# Altium project TG21_Slave_Device_Amply_V1.2.PrjPcb
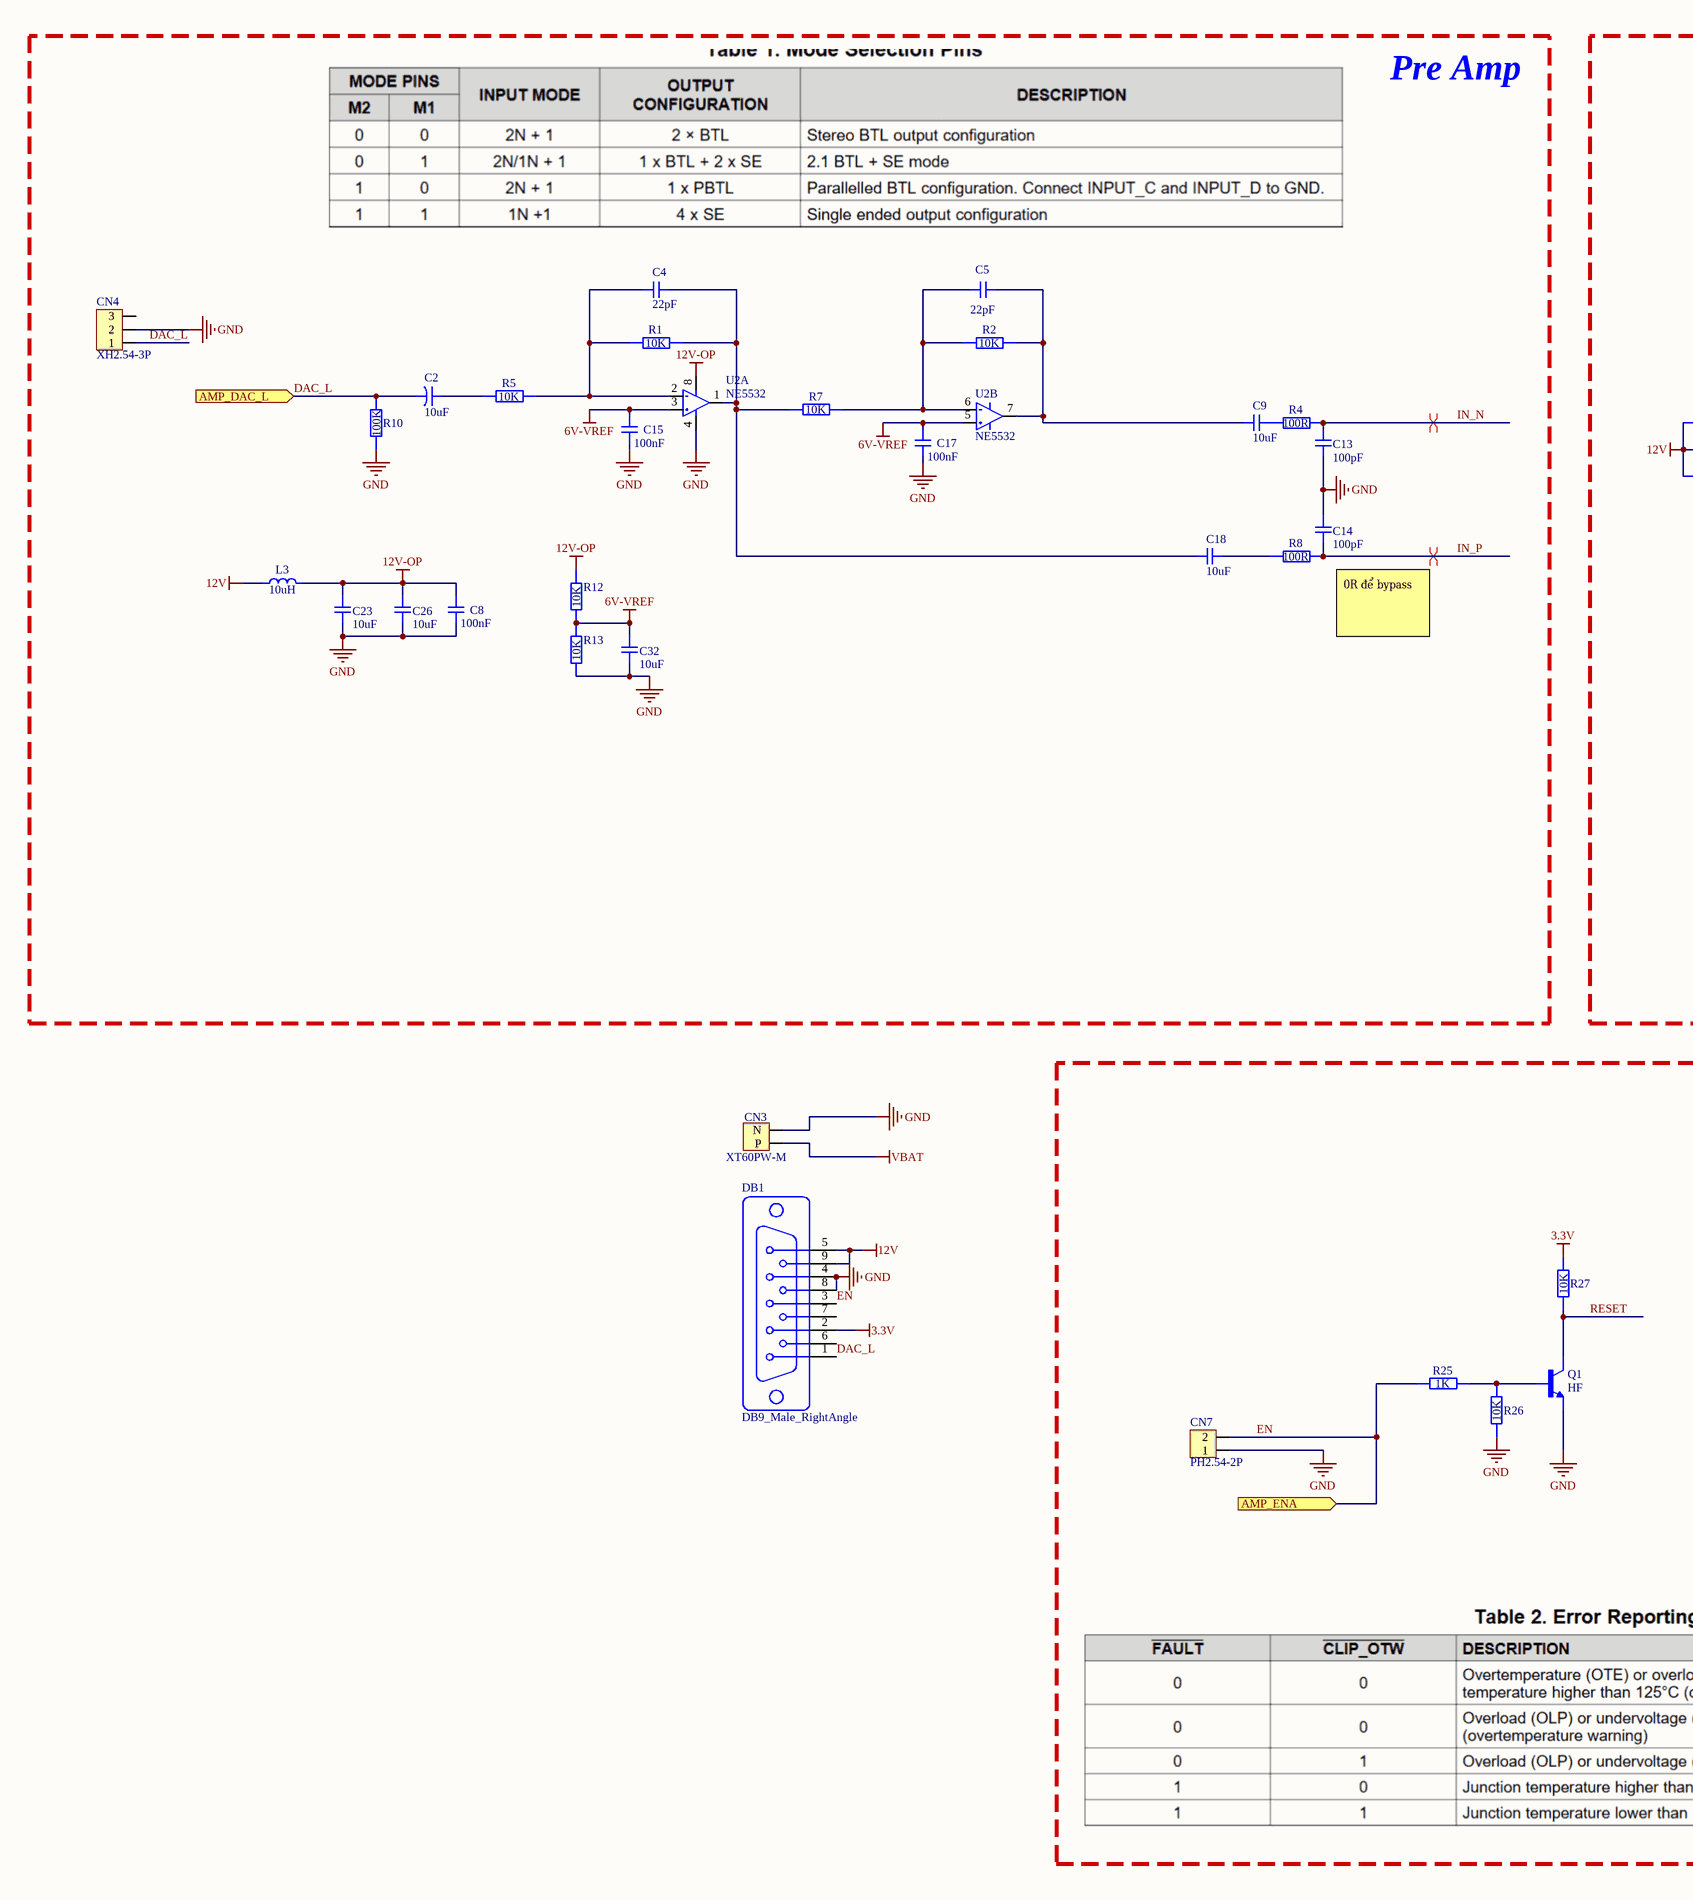
[diagram p0: TG21_Slave_Device_Amply.SchDoc, left]
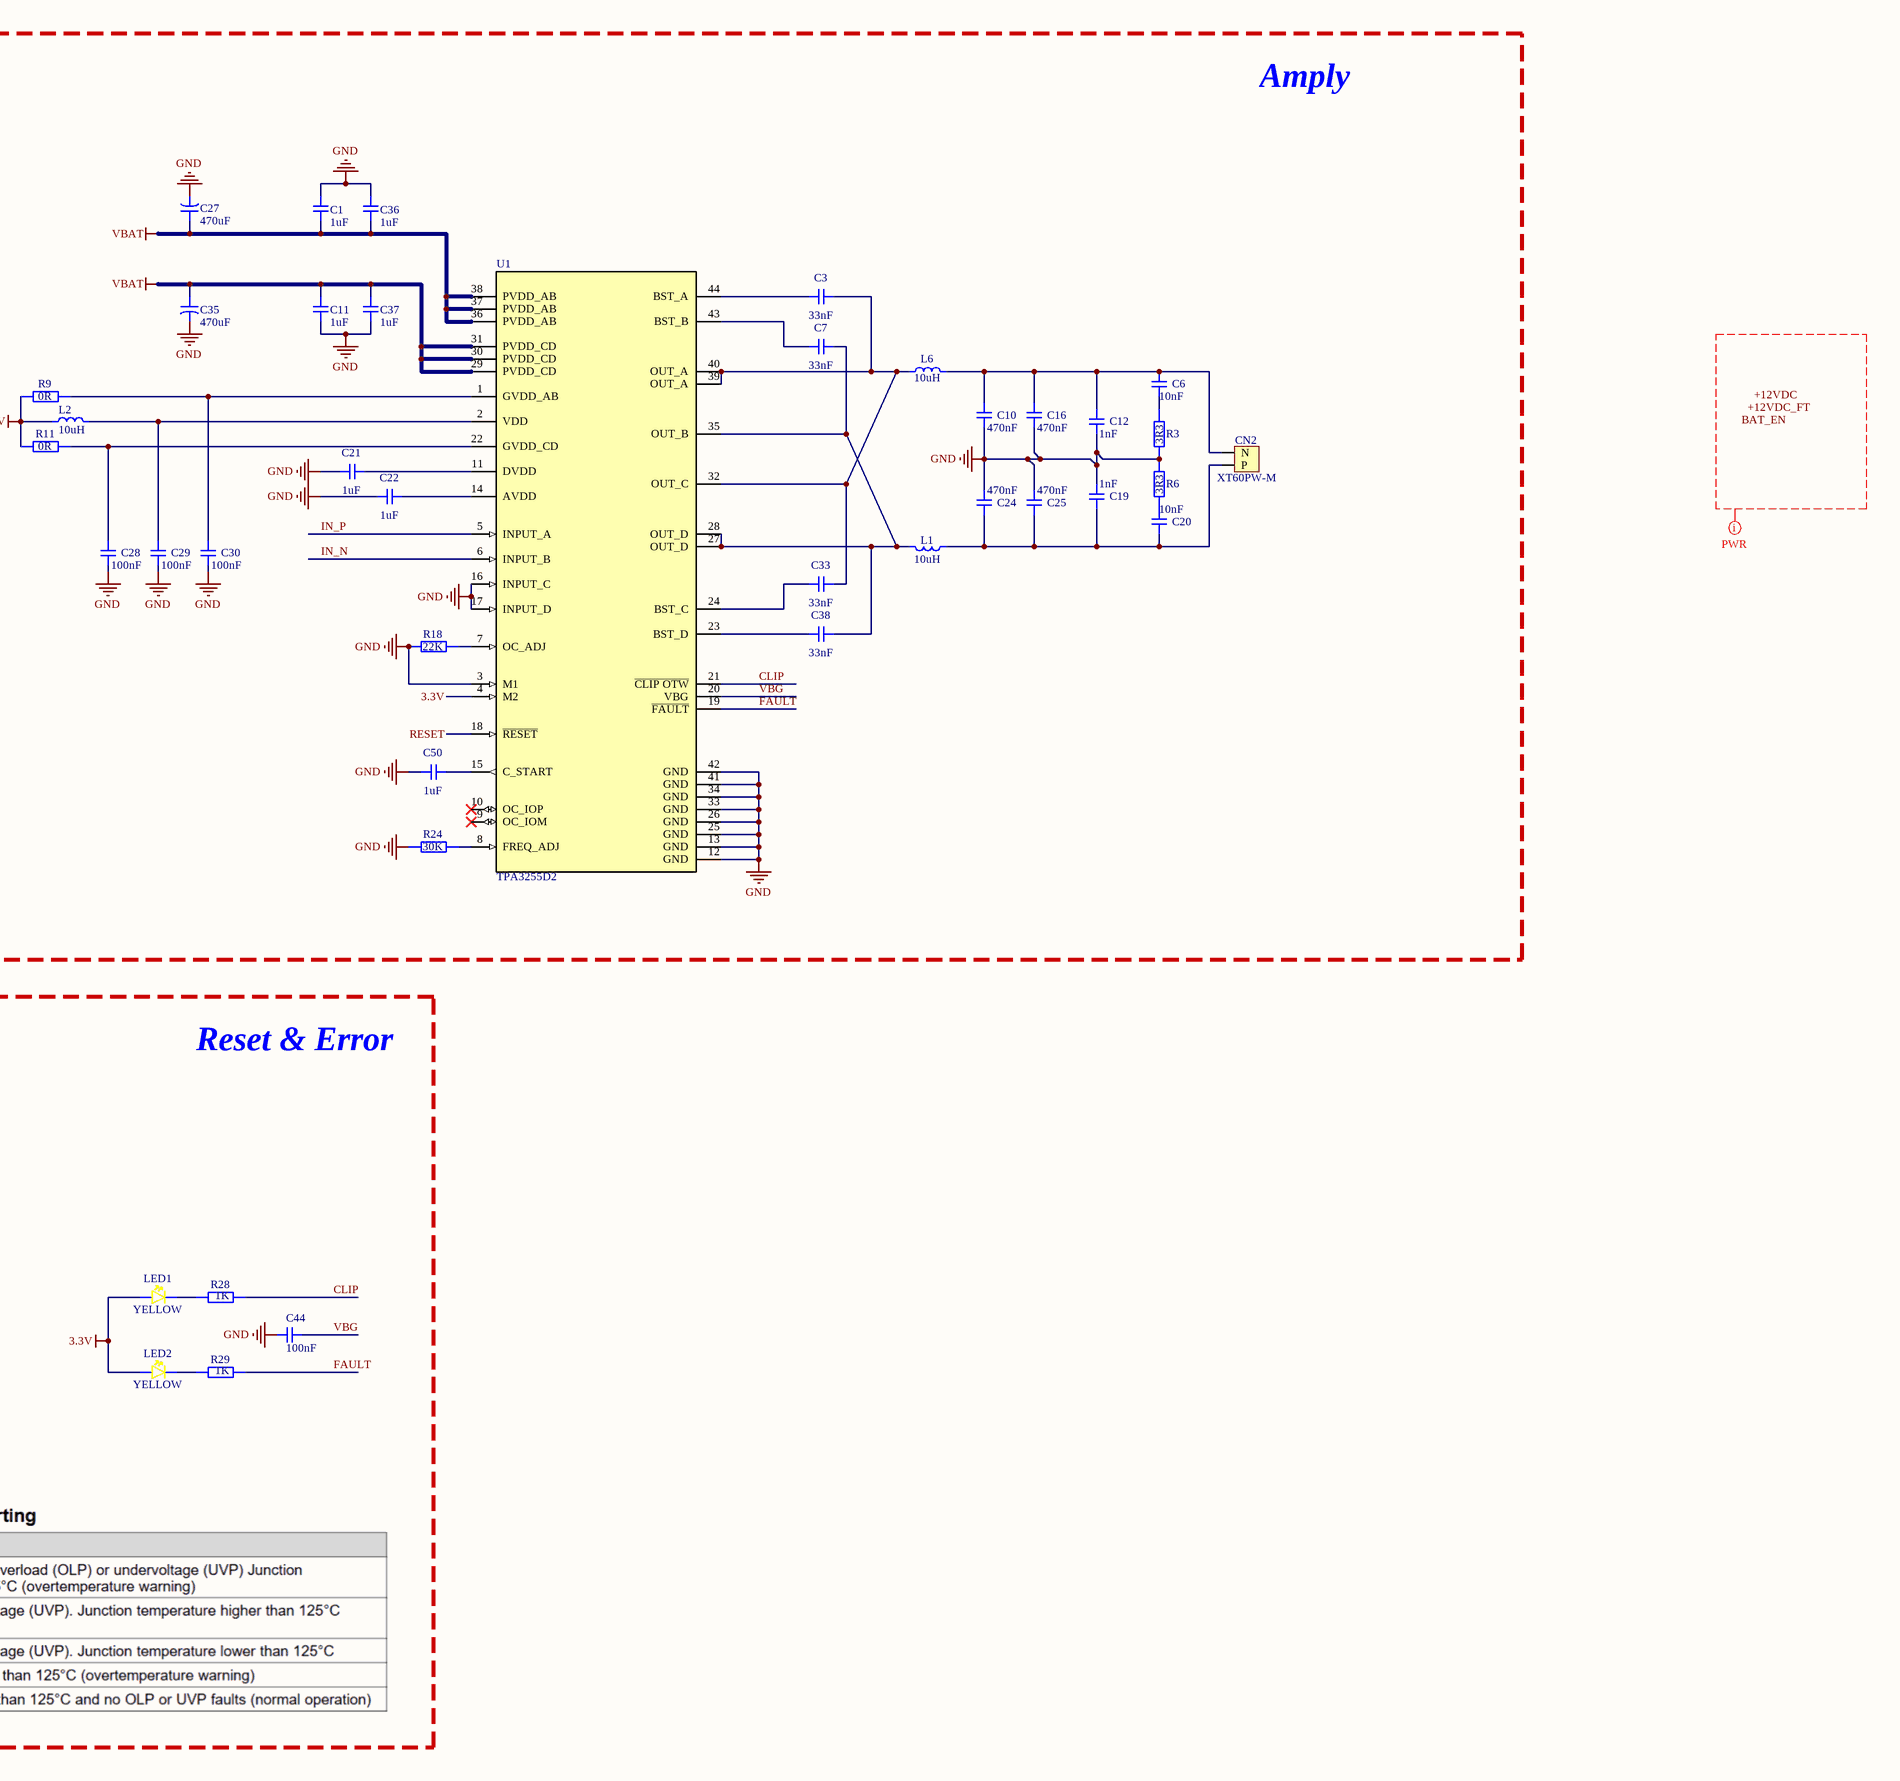
[diagram p1: TG21_Slave_Device_Amply.SchDoc, right]
1 sheet, 72 parts. Net scope: flat (ports and power ports of the same name join across sheets).
Board file: TG21_Slave_Device_Amply.PcbDoc

## Sheet TG21_Slave_Device_Amply.SchDoc
size A1; SheetNumber: 1; SheetTotal: 1

### Parts
C1  1uF  [CAP-0603]
C2  10uF  [PLUGIN,D5xL11mm]
C3  33nF  [CAP-0603]
C4  22pF  [CAP-0603]
C5  22pF  [CAP-0603]
C6  10nF  [CAP-0603]
C7  33nF  [CAP-0603]
C8  100nF  [CAP-0603]
C9  10uF  [CAP-0603]
C10  470nF  [CAP-1206 - 1]
C11  1uF  [CAP-0603]
C12  1nF  [CAP-0603]
C13  100pF  [CAP-0603]
C14  100pF  [CAP-0603]
C15  100nF  [CAP-0603]
C16  470nF  [CAP-1206 - 1]
C17  100nF  [CAP-0603]
C18  10uF  [CAP-0603]
C19  1nF  [CAP-0603]
C20  10nF  [CAP-0603]
C21  1uF  [CAP-0603]
C22  1uF  [CAP-0603]
C23  10uF  [CAP-0603]
C24  470nF  [CAP-1206 - 1]
C25  470nF  [CAP-1206 - 1]
C26  10uF  [CAP-0603]
C27  470uF  [Plugin,D10xL20mm]
C28  100nF  [CAP-0603]
C29  100nF  [CAP-0603]
C30  100nF  [CAP-0603]
C32  10uF  [CAP-0603]
C33  33nF  [CAP-0603]
C35  470uF  [Plugin,D10xL20mm]
C36  1uF  [CAP-0603]
C37  1uF  [CAP-0603]
C38  33nF  [CAP-0603]
C44  100nF  [CAP-0603]
C50  1uF  [CAP-0603]
CN2  XT60PW-M  [XT60PW-M]
CN3  XT60PW-M  [XT60PW-M]
CN4  XH2.54-3P  [Plugin,P=2.54mm,3P]
CN7  PH2.54-2P  [Plugin,P=2.54mm,2P,Pin Headers]
DB1  DB9_Male_RightAngle  [D-Sub, 9P, Through Hole,Right Angle]
L1  10uH  [RM6]
L2  10uH  [CAP-0603]
L3  10uH  [SMD,4x4x1.8mm(4018)]
L6  10uH  [RM6]
LED1  YELLOW  [LED-0603]
LED2  YELLOW  [LED-0603]
Q1  HF  [SOT-23]
R1  10K  [RES-0603]
R2  10K  [RES-0603]
R3  3R3  [RES-0603]
R4  100R  [RES-0603]
R5  10K  [RES-0603]
R6  3R3  [RES-0603]
R7  10K  [RES-0603]
R8  100R  [RES-0603]
R9  0R  [RES-0603]
R10  100K  [RES-0603]
R11  0R  [RES-0603]
R12  10K  [RES-0603]
R13  10K  [RES-0603]
R18  22K  [RES-0603]
R24  30K  [RES-0603]
R25  1K  [RES-0603]
R26  10K  [RES-0603]
R27  10K  [RES-0603]
R28  1K  [RES-0603]
R29  1K  [RES-0603]
U1  TPA3255D2  [HTSSOP-44-6.1mm-TPA3255]
U2  NE5532  [SOIC-8]  (parts A,B of 2)

### Blocks framed on the sheet
Pre Amp: C2 C4 C5 C8 C9 C13-C15 C17 C18 C23 C26 C32 CN4 L3 R1 R2 R4 R5 R7 R8 R10 R12 R13 U2
Amply: C1 C3 C6 C7 C10-C12 C16 C19-C22 C24 C25 C27-C30 C33 C35-C38 C50 CN2 L1 L2 L6 R3 R6 R9 R11 R18 R24 U1
Reset & Error: C44 CN7 LED1 LED2 Q1 R25-R29

### Ports
AMP_DAC_L (in), AMP_ENA (in)

### Nets
3.3V: DB1.2 LED1.1(A) LED2.1(A) R27.2 U1.4(M2)
6V-VREF: C15.1 C17.1 C32.1 R12.1 R13.2 U2.3(IN1+) U2.5(IN2+)
12V: DB1.5 DB1.9 L2.1 L3.1 R9.1 R11.1
12V-OP: C8.1 C23.1 C26.1 L3.2 R12.2 U2.8(VCC)
GND: C1.1 C8.2 C10.2 C11.2 C12.2 C13.2 C14.1 C15.2 C16.2 C17.2 C19.1 C21.2 C22.2 C23.2 C24.1 C25.1 C26.2 C27.2 C28.2 C29.2 C30.2 C32.2 C35.2 C36.1 C37.2 C44.1 C50.2 CN3.2(N) CN4.2 CN7.1 DB1.4 DB1.8 Q1.2(E) R3.1 R6.2 R10.2 R13.1 R18.1 R24.1 R26.1 U1.3(M1) U1.12(GND) U1.13(GND) U1.16(INPUT_C) U1.17(INPUT_D) U1.25(GND) U1.26(GND) U1.33(GND) U1.34(GND) U1.41(GND) U1.42(GND) U2.4(GND)
VBAT: C1.2 C11.1 C27.1 C35.1 C36.2 C37.1 CN3.1(P) U1.29(PVDD_CD) U1.30(PVDD_CD) U1.31(PVDD_CD) U1.36(PVDD_AB) U1.37(PVDD_AB) U1.38(PVDD_AB)
CLIP: R28.2 U1.21(~{CLIP_OTW})
DAC_L: C2.2 CN4.1 DB1.1 R10.1 ; port AMP_DAC_L
EN: CN7.2 DB1.3 R25.1 ; port AMP_ENA
FAULT: R29.2 U1.19(~{FAULT})
IN_N: C13.1 R4.2 U1.6(INPUT_B)
IN_P: C14.2 R8.2 U1.5(INPUT_A)
RESET: Q1.3(C) R27.1 U1.18(~{RESET})
VBG: C44.2 U1.20(VBG)
NetC2_1: C2.1 R5.1
NetC3_1: C3.1 C33.1 L6.2 U1.32(OUT_C) U1.39(OUT_A) U1.40(OUT_A)
NetC3_2: C3.2 U1.44(BST_A)
NetC4_1: C4.1 C18.2 R1.2 R7.1 U2.1(Out1)
NetC4_2: C4.2 R1.1 R5.2 U2.2(IN1-)
NetC5_1: C5.1 C9.2 R2.2 U2.7(Out2)
NetC5_2: C5.2 R2.1 R7.2 U2.6(IN2-)
NetC6_1: C6.1 C10.1 C12.1 C16.1 CN2.2(N) L6.1
NetC6_2: C6.2 R3.2
NetC7_1: C7.1 C38.1 L1.1 U1.27(OUT_D) U1.28(OUT_D) U1.35(OUT_B)
NetC7_2: C7.2 U1.43(BST_B)
NetC9_1: C9.1 R4.1
NetC18_1: C18.1 R8.1
NetC19_2: C19.2 C20.2 C24.2 C25.2 CN2.1(P) L1.2
NetC20_1: C20.1 R6.1
NetC21_1: C21.1 U1.11(DVDD)
NetC22_1: C22.1 U1.14(AVDD)
NetC28_1: C28.1 R11.2 U1.22(GVDD_CD)
NetC29_1: C29.1 L2.2 U1.2(VDD)
NetC30_1: C30.1 R9.2 U1.1(GVDD_AB)
NetC33_2: C33.2 U1.24(BST_C)
NetC38_2: C38.2 U1.23(BST_D)
NetC50_1: C50.1 U1.15(C_START)
NetLED1_2: LED1.2(K) R28.1
NetLED2_2: LED2.2(K) R29.1
NetQ1_1: Q1.1(B) R25.2 R26.2
NetR18_2: R18.2 U1.7(OC_ADJ)
NetR24_2: R24.2 U1.8(FREQ_ADJ)

Not connected (* = marked no-connect by the designer): CN4 3; DB1 6 7; U1 9(OC_IOM)* 10(OC_IOP)*

### Layout directives
differential pair: IN_N, IN_P
net class PWR: +12VDC, +12VDC_FT, BAT_EN

### Notes on the sheet
- 0R để bypass
- Labels drawn without touching a wire or pin: +12VDC, +12VDC_FT, BAT_EN

### Library data of the parts
C1 C11 C21 C22 C36 C37 C50 = CC0603KRX7R9BB105: 1uF ±10% 50V Ceramic Capacitor X7R 0603; Manufacturer: YAGEO; Mfr.Part #: CC0603KRX7R9BB105; Package: 0603; LCSC Part #: C559769; DigiKey Part Number: 311-2082-2-ND; ComponentLink1Description: Link; ComponentLink1URL: https://www.lcsc.com/product-detail/C559769.html?s_z=n_CC0603KRX7R9BB105; ComponentLink2Description: Link 1; ComponentLink2URL: https://www.digikey.com/en/products/detail/yageo/CC0603KRX7R9BB105/5883796?s=N4IgTCBcDaIMJwAwDZEGYDSAlAGgdiwE4AhYgRkQFYQBdAXyA
C2 = 50YXF10MEFC5X11: 10uF 50V Aluminum Electrolytic Capacitors Through Hole,D5xL11mm 5000hrs@105℃; Manufacturer: Rubycon; Mfr.Part #: 50YXF10MEFC5X11; Package: Through Hole,D5xL11mm; LCSC Part #: C88726; DigiKey Part Number: 1189-1852-ND; ComponentLink1Description: Link; ComponentLink1URL: https://www.lcsc.com/product-detail/C88726.html; ComponentLink2Description: Link 1; ComponentLink2URL: http://digikey.com/en/products/detail/rubycon/50YXF10MEFC5X11/3562878?s=N4IgTCBcDaIKwAYCaANAYgRgQWQKJoGE4UMMQBdAXyA
C3 C7 C33 C38 = CC0603KRX7R9BB333: 33nF ±10% 50V Ceramic Capacitor X7R 0603; Manufacturer: YAGEO; Package: 0603; Mfr.Part #: CC0603KRX7R9BB333; LCSC Part #: C106856; DigiKey Part Number: 311-1429-2-ND; ComponentLink1Description: Link; ComponentLink1URL: https://www.lcsc.com/product-detail/C106856.html?s_z=n_CC0603KRX7R9BB333; ComponentLink2Description: Link 1; ComponentLink2URL: https://www.digikey.com/en/products/detail/yageo/CC0603KRX7R9BB333/2833594?s=N4IgTCBcDaIMJwAwDZEGYDSAlAGgdiwE4AhYtckAXQF8g
C4 C5 = CC0603JRNPO9BN220: 22pF ±5% 50V Ceramic Capacitor NP0 0603; Manufacturer: YAGEO; Package: 0603; LCSC Part #: C105620; Mfr.Part #: CC0603JRNPO9BN220; DigiKey Part Number: 311-1062-2-ND; ComponentLink1Description: Link; ComponentLink1URL: https://www.lcsc.com/product-detail/C105620.html?s_z=n_CC0603JRNPO9BN220; ComponentLink2Description: Link 1; ComponentLink2URL: https://www.digikey.com/en/products/detail/yageo/CC0603JRNPO9BN220/302796?s=N4IgTCBcDaIMJwAwDZEGYBSAlAcgBQHkBOAIRzDERAF0BfIA
C6 C20 = CC0603JRX7R9BB103: 10nF ±5% 50V Ceramic Capacitor X7R 0603; Manufacturer: YAGEO; Mfr.Part #: CC0603JRX7R9BB103; Package: 0603; LCSC Part #: C115056; DigiKey Part Number: 311-1778-2-ND; ComponentLink1Description: Link; ComponentLink1URL: https://www.lcsc.com/product-detail/C115056.html?s_z=n_C115056; ComponentLink2Description: Link 1; ComponentLink2URL: https://www.digikey.com/en/products/detail/yageo/CC0603JRX7R9BB103/5195187?s=N4IgTCBcDaIMJwAwDZEGYBSAlAGgdiwE4AhYgRnRAF0BfIA
C8 C15 C17 C28-C30 C44 = CC0603KRX7R9BB104: 100nF ±10% 50V Ceramic Capacitor X7R 0603; Manufacturer: YAGEO; Package: 0603; LCSC Part #: C14663; Mfr.Part #: CC0603KRX7R9BB104; DigiKey Part Number: 311-1344-2-ND; ComponentLink1Description: Link; ComponentLink1URL: https://www.lcsc.com/product-detail/C14663.html?s_z=n_C14663; ComponentLink2Description: Link 1; ComponentLink2URL: https://www.digikey.com/en/products/detail/yageo/CC0603KRX7R9BB104/2103082?s=N4IgTCBcDaIMwEYEFoFwCzuWZA5AIiALoC%2BQA
C9 C18 C23 C26 C32 = CL10A106MA8NRNC: 10uF ±20% 25V Ceramic Capacitor X5R 0603; Manufacturer: Samsung Electro-Mechanics; Package: 0603; Mfr.Part #: CL10A106MA8NRNC; LCSC Part #: C96446; DigiKey Part Number: 1276-1869-2-ND; ComponentLink1Description: Link; ComponentLink1URL: https://www.lcsc.com/product-detail/C96446.html?s_z=n_CL10A106MA8NRNC; ComponentLink2Description: Link 1; ComponentLink2URL: https://www.digikey.com/en/products/detail/samsung-electro-mechanics/CL10A106MA8NRNC/3887527?s=N4IgTCBcDaIMIBkCMAGAgqgbAWTQDgDkAlAuEAXQF8g
C10 C16 C24 C25 = 1206B474K101NT: 470nF ±10% 100V Ceramic Capacitor X7R 1206; Manufacturer: FH; Mfr.Part #: 1206B474K101NT; Package: 1206; LCSC Part #: C507059; DigiKey Part Number: NO; ComponentLink1Description: Link; ComponentLink1URL: https://www.lcsc.com/product-detail/C507059.html; ComponentLink2Description: Link 1
C12 C19 = CC0603KRX7R9BB102: 1nF ±10% 50V Ceramic Capacitor X7R 0603; Manufacturer: YAGEO; Package: 0603; LCSC Part #: C100040; Mfr.Part #: CC0603KRX7R9BB102; DigiKey Part Number: 311-1080-2-ND; ComponentLink1Description: Link; ComponentLink1URL: https://www.lcsc.com/product-detail/C100040.html?s_z=n_C100040; ComponentLink2Description: Link 1; ComponentLink2URL: https://www.digikey.com/en/products/detail/yageo/CC0603KRX7R9BB102/302814?s=N4IgTCBcDaIMJwAwDZEGYDSAlAGgdiwE4AhYgRkQgF0BfIA
C13 C14 = CL10C101JB8NNNC: 100pF ±5% 50V Ceramic Capacitor C0G 0603; Manufacturer: Samsung Electro-Mechanics; Package: 0603; Mfr.Part #: CL10C101JB8NNNC; LCSC Part #: C14858; DigiKey Part Number: 1276-1008-2-ND; ComponentLink1Description: Link; ComponentLink1URL: https://www.lcsc.com/product-detail/C14858.html?s_z=n_CL10C101JBNNNC; ComponentLink2Description: Link 1; ComponentLink2URL: https://www.digikey.com/en/products/detail/samsung-electro-mechanics/CL10C101JB8NNNC/3886666?s=N4IgTCBcDaIMIBkCMAGOqkCkBCAOAcoXCALoC%2BQA
C27 C35 = 50PX470MEFC10X20: 470uF 50V Aluminum Electrolytic Capacitors Through Hole,D10xL20mm 2000hrs@105℃; Manufacturer: Rubycon; Mfr.Part #: 50PX470MEFC10X20; LCSC Part #: C88733; Package: Through Hole,D10xL20mm; DigiKey Part Number: 1189-4213-ND; ComponentLink1Description: Link; ComponentLink1URL: https://www.lcsc.com/product-detail/C88733.html; ComponentLink2Description: Link 1; ComponentLink2URL: https://www.digikey.com/en/products/detail/rubycon/50PX470MEFC10X20/3563766?s=N4IgTCBcDaIKwAYAKANALAdgQWQKIDEBhARgRTARAF0BfIA
CN2 CN3 = XT60PW-M: Banana and Tip Connector Adapters RoHS; Manufacturer: Changzhou Amass Elec; Mfr.Part #: XT60PW-M; LCSC Part #: C98732; Package: XT60PW-M; DigiKey Part Number: NO; ComponentLink1Description: Link; ComponentLink1URL: https://www.lcsc.com/product-detail/C98732.html?s_z=n_XT60
CN4 = BX-XH2.54-3PZZ: Connector Header 3 position 2.5mm Pitch 3A Through Hole -25℃~+85℃; Manufacturer: Bossie; Mfr.Part #: BX-XH2.54-3PZZ; LCSC Part #: C18077834; Package: Through Hole,P=2.5mm; DigiKey Part Number: NO; ComponentLink1Description: Link; ComponentLink1URL: https://www.lcsc.com/product-detail/C18077834.html?s_z=n_BX-XH2.54-3PZZ
CN7 = PH2.54-1X2P-H25: Pin Header 2 Position 2.54mm Pitch Single Row Through Hole -40℃~+105℃; Manufacturer: JXTCONN; Mfr.Part #: PH2.54-1X2P-H25; LCSC Part #: C42431798; Package: Through Hole,P=2.54mm; DigiKey Part Number: NO; ComponentLink1Description: Link; ComponentLink1URL: https://www.lcsc.com/product-detail/C42431798.html?s_z=n_2.54-1%2a2P
DB1 = DB9_Male_RightAngle: Connector D-Sub, Male 9 Position 2 Row Through Hole, Right Angle; Manufacturer: XUNPU; Mfr. Part #: D-SUB-DR-9PCG-BB; Key Attributes: CONN D-SUB PLUG 9POS TH R/A; ComponentLink1Description: Link; ComponentLink1URL: https://www.lcsc.com/product-detail/C19077344.html?s_z=n_q_p_DB9%2520male&spm=wm.ssy.bg.0.xh&lcsc_vid=Q1VfX1ReRFFaUFJSRgIIUV0CFFgIBFJfT1hdVlwEEVkxVlNRT1RZXlVVRlhaVjsOAxUeFF5JWBYZEEoKFBINSQcJGk4dAgUUFAk%3D; LCSC Part #: C19077344; Package: Through Hole,Right Angle
L1 L6 = RM6-10UH18A: 10uH SMD, 21.5x22.5mm, 5mΩ, Isat 12A; Manufacturer: NO; Mfr.Part #: MTP2012S-100MC; DigiKey Part Number: NO; LCSC Part #: NO; Package: Through Hole,19x13mm; ComponentLink1Description: Link; ComponentLink1URL: https://detail.tmall.com/item.htm?abbucket=13&id=830337168403&mi_id=0000HfZtw201IDY-IbBo5SBGln4Rs-xlnrA7bLsp8-ByO4c&ns=1&priceTId=2100cff517743435818743772e0cc2&skuId=5563931960630&spm=a21n57.1.hoverItem.11&utparam=%7B%22aplus_abtest%22%3A%2250db852e2facc06d265983063d788b35%22%7D&xxc=taobaoSearch; ComponentLink2Description: Link 1
L2 = MLZ1608M100WT000: 250mA 10uH 90mA 1.05Ω Multilayer inductor ±20% 0603 Fixed Inductors RoHS; Manufacturer: TDK; Mfr.Part #: MLZ1608M100WT000; LCSC Part #: C76798; Package: 0603; DigiKey Part Number: 445-6389-2-ND; ComponentLink1Description: Link; ComponentLink1URL: https://www.lcsc.com/product-detail/C76798.html; ComponentLink2Description: Link 1; ComponentLink2URL: https://www.digikey.com/en/products/detail/tdk/MLZ1608M100WT000/2465148?s=N4IgTCBcDaILIBkBaBGAbABgBxxRjA6gCr4YgC6AvkA
L3 = FNR4018S100MT: 1.2A 10uH Magnetic Shielded Inductor ±20% 1.6A 234mΩ SMD,4x4mm Fixed Inductors RoHS; Manufacturer: cjiang; Mfr.Part #: FNR4018S100MT; Package: SMD,4x4mm; LCSC Part #: C167808; DigiKey Part Number: NO
LED1 LED2 = KO-0603QYGC/6: 0603 YELLOW; Manufacturer: NO; Mfr.Part #: KO-0603QYGC/6; Package: 0603; LCSC Part #: NO; DigiKey Part Number: NO; ComponentLink1Description: Link; ComponentLink2Description: Link 1
Q1 = 2SC1815: Bipolar (BJT) Transistor NPN 50V 0.15A 80MHz 200mW Surface Mount SOT-23; Manufacturer: R+O; Mfr.Part #: 2SC1815; LCSC Part #: C20069143; Package: SOT-23; DigiKey Part Number: NO; ComponentLink1Description: Link; ComponentLink1URL: https://www.lcsc.com/product-detail/C20069143.html?s_z=n_2SC1815
R1 R2 R5 R7 R12 R13 R26 R27 = RC0603FR-0710KL: 100mW 10kΩ 75V Thick Film Resistor ±100ppm/℃ ±1% 0603 Chip Resistor - Surface Mount RoHS; Manufacturer: YAGEO; Package: 0603; LCSC Part #: C98220; Mfr.Part #: RC0603FR-0710KL; DigiKey Part Number: 311-10.0KHRTR-ND; ComponentLink1Description: Link; ComponentLink1URL: https://www.lcsc.com/product-detail/C98220.html?s_z=n_C98220; ComponentLink2Description: Link 1; ComponentLink2URL: https://www.digikey.com/en/products/detail/yageo/RC0603FR-0710KL/726880?s=N4IgTCBcDaIMwEYEFoEAYB0aDSAJASgCr7IByAIiALoC%2BQA
R3 R6 = RC0603FR-073R3L: 100mW 3.3Ω 75V Thick Film Resistor ±1% ±200ppm/℃ 0603 Chip Resistor - Surface Mount RoHS; Manufacturer: YAGEO; Mfr.Part #: RC0603FR-073R3L; Package: 0603; LCSC Part #: C137725; DigiKey Part Number: 13-RC0603FR-073R3LTR-ND; ComponentLink1Description: Link; ComponentLink1URL: https://www.lcsc.com/product-detail/C137725.html?s_z=n_RC0603FR-073R3L; ComponentLink2Description: Link 1; ComponentLink2URL: https://www.digikey.com/en/products/detail/yageo/RC0603FR-073R3L/5918348?s=N4IgTCBcDaIEoGEAMA2JBmAYnAtEg7OnOgDIgC6AvkA
R4 R8 = RC0603FR-07100RL: 100mW 100Ω 75V Thick Film Resistor ±100ppm/℃ ±1% 0603 Chip Resistor - Surface Mount RoHS; Manufacturer: YAGEO; Mfr.Part #: RC0603FR-07100KL; Package: 0603; LCSC Part #: C105588; DigiKey Part Number: 311-100HRTR-ND; ComponentLink1Description: Link; ComponentLink1URL: https://www.lcsc.com/product-detail/C105588.html?s_z=n_RC0603FR-07100RL; ComponentLink2Description: Link 1; ComponentLink2URL: https://www.digikey.com/en/products/detail/yageo/RC0603FR-07100RL/726888?s=N4IgTCBcDaIEoGEAMA2JBmAYnAtEg7AIxJJwAyIAugL5A
R9 R11 = RC0603FR-070RL: 0Ω 100mW 75V Thick Film Resistor ±1% 0603 Chip Resistor - Surface Mount RoHS; Manufacturer: YAGEO; Mfr.Part #: RC0603FR-070RL; Package: 0603; LCSC Part #: C100044; DigiKey Part Number: 311-0.0HRTR-ND; ComponentLink1Description: Link; ComponentLink1URL: https://www.lcsc.com/product-detail/C100044.html?s_z=n_0R; ComponentLink2Description: Link 1; ComponentLink2URL: https://www.digikey.com/en/products/detail/yageo/RC0603FR-070RL/1304008?s=N4IgTCBcDaIEoGEAMA2JBmAYnAtEg7EnADIgC6AvkA
R10 = RC0603FR-07100KL: 100mW 100kΩ 75V Thick Film Resistor ±100ppm/℃ ±1% 0603 Chip Resistor - Surface Mount RoHS; Manufacturer: YAGEO; Mfr.Part #: RC0603FR-07100KL; Package: 0603; LCSC Part #: C14675; DigiKey Part Number: 311-100KHRTR-ND; ComponentLink1Description: Link; ComponentLink1URL: https://www.lcsc.com/product-detail/C14675.html?s_z=n_RC0603FR-07100KL; ComponentLink2Description: Link 1; ComponentLink2URL: https://www.digikey.com/en/products/detail/yageo/RC0603FR-07100KL/726889?s=N4IgTCBcDaIEoGEAMA2JBmAYnAtEg7AIxJIDSAMiALoC%2BQA
R18 = RC0603FR-0722KL: 100mW 22kΩ 75V Thick Film Resistor ±100ppm/℃ ±1% 0603 Chip Resistor - Surface Mount RoHS; Manufacturer: YAGEO; Mfr.Part #: RC0603FR-0722KL; Package: 0603; LCSC Part #: C114065; DigiKey Part Number: 311-22.0KHRTR-ND; ComponentLink1Description: Link; ComponentLink1URL: https://www.lcsc.com/product-detail/C114065.html?s_z=n_22K; ComponentLink2Description: Link 1; ComponentLink2URL: https://www.digikey.com/en/products/detail/yageo/RC0603FR-0722KL/727056?s=N4IgTCBcDaIEoGEAMA2JBmAYnAtEg7GGANIAyIAugL5A
R24 = RC0603FR-0730KL: 100mW 30kΩ 75V Thick Film Resistor ±100ppm/℃ ±1% 0603 Chip Resistor - Surface Mount RoHS; Manufacturer: YAGEO; Mfr.Part #: RC0603FR-0730KL; Package: 0603; LCSC Part #: C100001; DigiKey Part Number: 311-30.0KHRTR-ND; ComponentLink1Description: Link; ComponentLink1URL: https://www.lcsc.com/product-detail/C100001.html?s_z=n_30K; ComponentLink2Description: Link 1; ComponentLink2URL: https://www.digikey.com/en/products/detail/yageo/RC0603FR-0730KL/727140?s=N4IgTCBcDaIEoGEAMA2JBmAYnAtEg7OkgNIAyIAugL5A
R25 R28 R29 = RC0603FR-071KL: 100mW 1kΩ 75V Thick Film Resistor ±100ppm/℃ ±1% 0603 Chip Resistor - Surface Mount RoHS; Manufacturer: YAGEO; Mfr.Part #: RC0603FR-071KL; Package: 0603; LCSC Part #: C22548; DigiKey Part Number: 311-1.00KHRTR-ND; ComponentLink1Description: Link; ComponentLink1URL: https://www.lcsc.com/product-detail/C22548.html?s_z=n_C22548; ComponentLink2Description: Link 1; ComponentLink2URL: https://www.digikey.com/en/products/detail/yageo/RC0603FR-071KL/726843?s=N4IgTCBcDaIEoGEAMA2JBmAYnAtEg7AIwDSAMiALoC%2BQA
U1 = TPA3255: Amplifier IC 2-Channel (Stereo) Class D 44-HTSSOP; Manufacturer: Texas Instruments; Manufacturer Product Number: TPA3255DDVR; Key Attributes: IC AMP CLSS D STER 315W 44HTSSOP; ComponentLink1Description: Link; ComponentLink1URL: https://www.digikey.com/en/products/detail/texas-instruments/TPA3255DDVR/6235425
U2 = NE5532: 2 500uV 9V/us 100dB 1uA 16mA 10MHz SOIC-8 Instrumentation, Op Amps, Buffer Amps RoHS; Manufacturer: TI; Mfr. Part #: NE5532DR; Key Attributes: Dual Low-Noise Operational Amplifiers; ComponentLink1Description: Link; ComponentLink1URL: https://www.lcsc.com/product-detail/C7426.html?s_z=n_q_ne5532&spm=wm.fly.bg.0.xh&lcsc_vid=Q1VfX1ReRFFaUFJSRgIIUV0CFFgIBFJfT1hdVlwEEVkxVlNRT1RZX11SQlhYUzsOAxUeFF5JWBYZEEoKFBINSQcJGk4eFQsCAgIaSgADAwAHC0slT1RfV1RIHxUDCw%3D%3D; LCSC Part #: C7426; Package: SOIC-8